# Altium schematic sheet [13]-FPGA_Bank_6_Interface.SchDoc
size A3
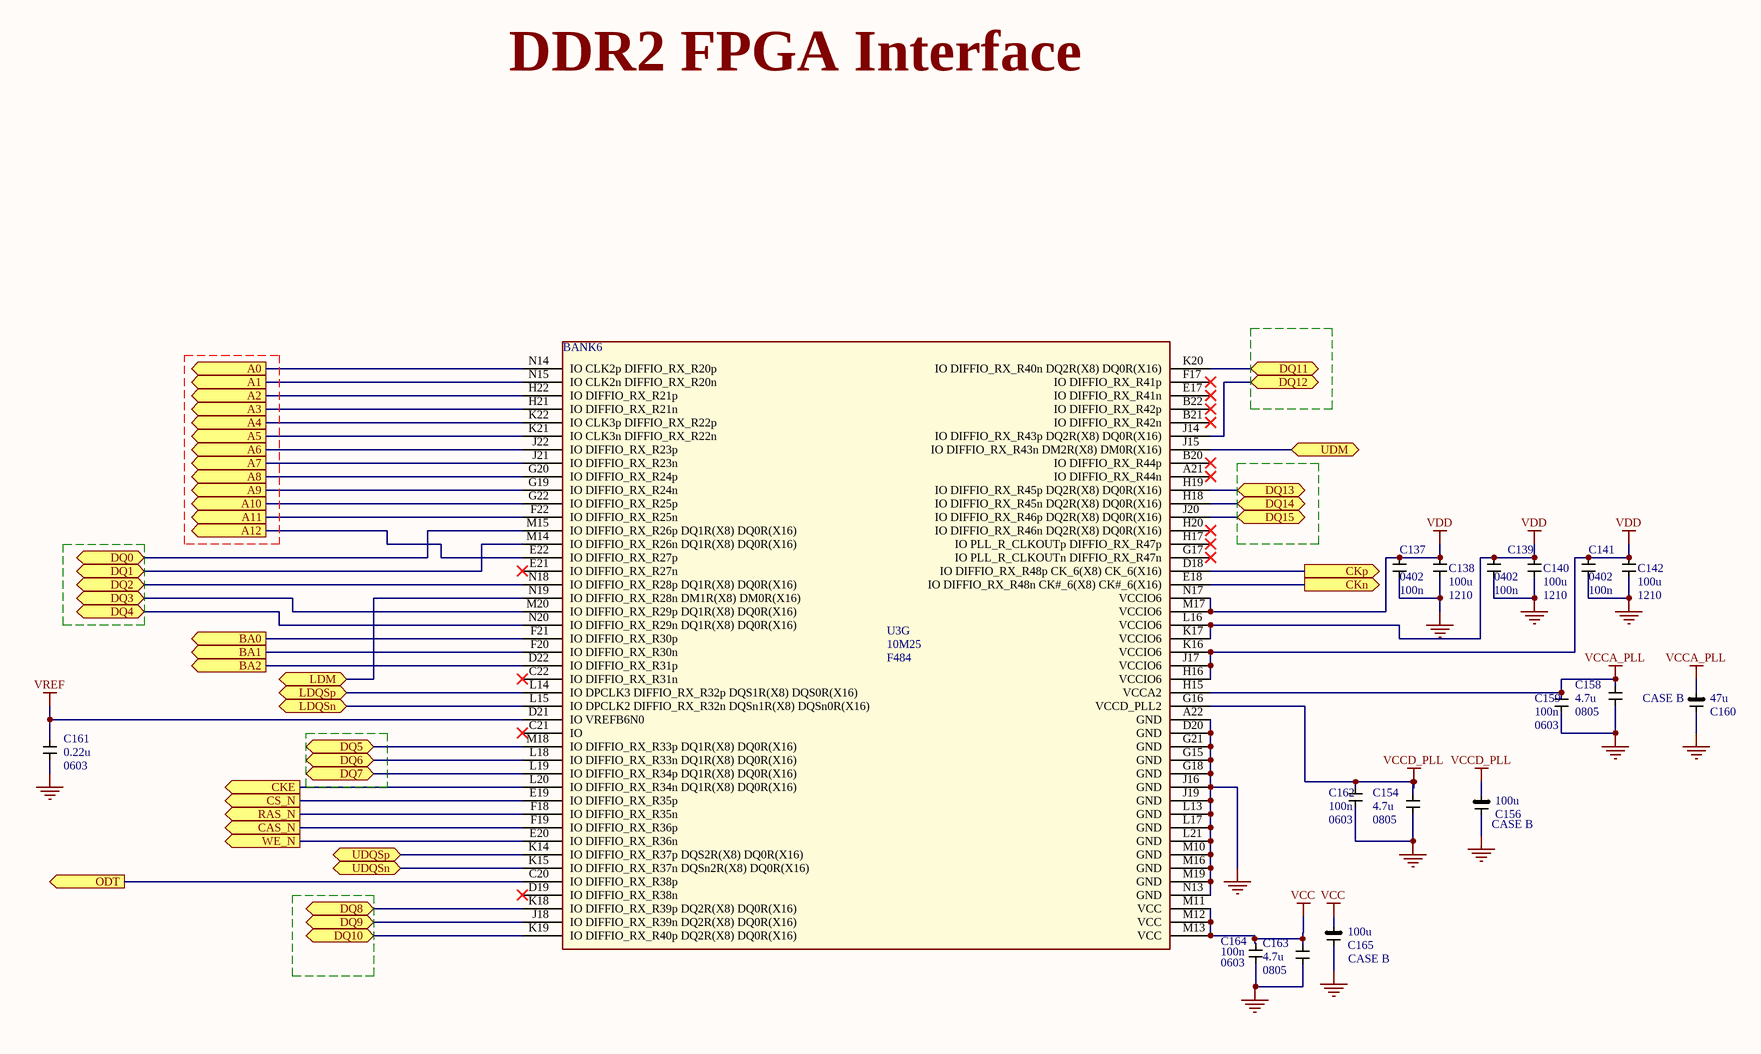
[diagram p0: [13]-FPGA_Bank_6_Interface.SchDoc]

## Parts
C137  100n
C138  100u  PCB package type: 1210  [CAPC3225X28N]
C139  100n
C140  100u  PCB package type: 1210  [CAPC3225X28N]
C141  100n
C142  100u  PCB package type: 1210  [CAPC3225X28N]
C154  4.7u  PCB footprint: 0805
C156  100u  CASE: CASE B  [CAPC3529X21N]
C158  4.7u  PCB footprint: 0805
C159  100n  PCB Layer:: 0603  [*0603]
C160  47u  CASE: CASE B  [CAPC3529X21N]
C161  0.22u  PCB Layer:: 0603  [*0603]
C162  100n  PCB Layer:: 0603  [*0603]
C163  4.7u  PCB footprint: 0805
C164  100n  PCB Layer:: 0603  [*0603]
C165  100u  CASE: CASE B  [CAPC3529X21N]
U3  10M25  Package Type: F484  [*BGA484C100P22X22_2300X2300X200N]  (part G of 9)

## Ports
A0 (out), A1 (out), A2 (out), A3 (out), A4 (out), A5 (out), A6 (out), A7 (out), A8 (out), A9 (out), A10 (out), A11 (out), A12 (out), BA0 (out), BA1 (out), BA2 (out), CAS_N (out), CKE (out), CKn (out), CKp (out), CS_N (out), DQ0, DQ1, DQ2, DQ3, DQ4, DQ5, DQ6, DQ7, DQ8, DQ9, DQ10, DQ11, DQ12, DQ13, DQ14, DQ15, LDM (bidir), LDQSn (bidir), LDQSp (bidir), ODT (out), RAS_N (out), UDM, UDQSn (bidir), UDQSp (bidir), WE_N (out)

## Nets
GND: C137.1 C138.1 C139.1 C140.1 C141.1 C142.1 C154.1 C156.2 C158.1 C159.1 C160.2 C161.1 C162.1 C163.1 C164.1 C165.2 U3.A22(GND) U3.D20(GND) U3.G15(GND) U3.G18(GND) U3.G21(GND) U3.J16(GND) U3.J19(GND) U3.L13(GND) U3.L17(GND) U3.L21(GND) U3.M10(GND) U3.M16(GND) U3.M19(GND) U3.N13(GND)
VCC: C163.2 C164.2 C165.1 U3.M11(VCC) U3.M12(VCC) U3.M13(VCC)
VCCA_PLL: C158.2 C159.2 C160.1 U3.H15(VCCA2)
VCCD_PLL: C154.2 C156.1 C162.2 U3.G16(VCCD_PLL2)
VDD: C137.2 C138.2 C139.2 C140.2 C141.2 C142.2 U3.H16(VCCIO6) U3.J17(VCCIO6) U3.K16(VCCIO6) U3.K17(VCCIO6) U3.L16(VCCIO6) U3.M17(VCCIO6) U3.N17(VCCIO6)
VREF: C161.2 U3.D21(IO_VREFB6N0)
A0: U3.N14(IO_CLK2p_DIFFIO_RX_R20p) ; port A0
A1: U3.N15(IO_CLK2n_DIFFIO_RX_R20n) ; port A1
A2: U3.H22(IO_DIFFIO_RX_R21p) ; port A2
A3: U3.H21(IO_DIFFIO_RX_R21n) ; port A3
A4: U3.K22(IO_CLK3p_DIFFIO_RX_R22p) ; port A4
A5: U3.K21(IO_CLK3n_DIFFIO_RX_R22n) ; port A5
A6: U3.J22(IO_DIFFIO_RX_R23p) ; port A6
A7: U3.J21(IO_DIFFIO_RX_R23n) ; port A7
A8: U3.G20(IO_DIFFIO_RX_R24p) ; port A8
A9: U3.G19(IO_DIFFIO_RX_R24n) ; port A9
A10: U3.G22(IO_DIFFIO_RX_R25p) ; port A10
A11: U3.F22(IO_DIFFIO_RX_R25n) ; port A11
A12: U3.E22(IO_DIFFIO_RX_R27p) ; port A12
BA0: U3.F21(IO_DIFFIO_RX_R30p) ; port BA0
BA1: U3.F20(IO_DIFFIO_RX_R30n) ; port BA1
BA2: U3.D22(IO_DIFFIO_RX_R31p) ; port BA2
CAS_N: U3.F19(IO_DIFFIO_RX_R36p) ; port CAS_N
CKE: U3.L20(IO_DIFFIO_RX_R34n_DQ1R(X8)_DQ0R(X16)) ; port CKE
CKn: U3.E18(IO_DIFFIO_RX_R48n_CK#_6(X8)_CK#_6(X16)) ; port CKn
CKp: U3.D18(IO_DIFFIO_RX_R48p_CK_6(X8)_CK_6(X16)) ; port CKp
CS_N: U3.E19(IO_DIFFIO_RX_R35p) ; port CS_N
DQ0: U3.M15(IO_DIFFIO_RX_R26p_DQ1R(X8)_DQ0R(X16)) ; port DQ0
DQ1: U3.M14(IO_DIFFIO_RX_R26n_DQ1R(X8)_DQ0R(X16)) ; port DQ1
DQ2: U3.N18(IO_DIFFIO_RX_R28p_DQ1R(X8)_DQ0R(X16)) ; port DQ2
DQ3: U3.M20(IO_DIFFIO_RX_R29p_DQ1R(X8)_DQ0R(X16)) ; port DQ3
DQ4: U3.N20(IO_DIFFIO_RX_R29n_DQ1R(X8)_DQ0R(X16)) ; port DQ4
DQ5: U3.M18(IO_DIFFIO_RX_R33p_DQ1R(X8)_DQ0R(X16)) ; port DQ5
DQ6: U3.L18(IO_DIFFIO_RX_R33n_DQ1R(X8)_DQ0R(X16)) ; port DQ6
DQ7: U3.L19(IO_DIFFIO_RX_R34p_DQ1R(X8)_DQ0R(X16)) ; port DQ7
DQ8: U3.K18(IO_DIFFIO_RX_R39p_DQ2R(X8)_DQ0R(X16)) ; port DQ8
DQ9: U3.J18(IO_DIFFIO_RX_R39n_DQ2R(X8)_DQ0R(X16)) ; port DQ9
DQ10: U3.K19(IO_DIFFIO_RX_R40p_DQ2R(X8)_DQ0R(X16)) ; port DQ10
DQ11: U3.K20(IO_DIFFIO_RX_R40n_DQ2R(X8)_DQ0R(X16)) ; port DQ11
DQ12: U3.J14(IO_DIFFIO_RX_R43p_DQ2R(X8)_DQ0R(X16)) ; port DQ12
DQ13: U3.H19(IO_DIFFIO_RX_R45p_DQ2R(X8)_DQ0R(X16)) ; port DQ13
DQ14: U3.H18(IO_DIFFIO_RX_R45n_DQ2R(X8)_DQ0R(X16)) ; port DQ14
DQ15: U3.J20(IO_DIFFIO_RX_R46p_DQ2R(X8)_DQ0R(X16)) ; port DQ15
LDM: U3.N19(IO_DIFFIO_RX_R28n_DM1R(X8)_DM0R(X16)) ; port LDM
LDQSn: U3.L15(IO_DPCLK2_DIFFIO_RX_R32n_DQSn1R(X8)_DQSn0R(X16)) ; port LDQSn
LDQSp: U3.L14(IO_DPCLK3_DIFFIO_RX_R32p_DQS1R(X8)_DQS0R(X16)) ; port LDQSp
ODT: U3.C20(IO_DIFFIO_RX_R38p) ; port ODT
RAS_N: U3.F18(IO_DIFFIO_RX_R35n) ; port RAS_N
UDM: U3.J15(IO_DIFFIO_RX_R43n_DM2R(X8)_DM0R(X16)) ; port UDM
UDQSn: U3.K15(IO_DIFFIO_RX_R37n_DQSn2R(X8)_DQ0R(X16)) ; port UDQSn
UDQSp: U3.K14(IO_DIFFIO_RX_R37p_DQS2R(X8)_DQ0R(X16)) ; port UDQSp
WE_N: U3.E20(IO_DIFFIO_RX_R36n) ; port WE_N

Not connected (* = marked no-connect by the designer): U3 A21(IO_DIFFIO_RX_R44n)* B20(IO_DIFFIO_RX_R44p)* B21(IO_DIFFIO_RX_R42n)* B22(IO_DIFFIO_RX_R42p)* C21(IO)* C22(IO_DIFFIO_RX_R31n)* D19(IO_DIFFIO_RX_R38n)* E17(IO_DIFFIO_RX_R41n)* E21(IO_DIFFIO_RX_R27n)* F17(IO_DIFFIO_RX_R41p)* G17(IO_PLL_R_CLKOUTn_DIFFIO_RX_R47n)* H17(IO_PLL_R_CLKOUTp_DIFFIO_RX_R47p)* H20(IO_DIFFIO_RX_R46n_DQ2R(X8)_DQ0R(X16))*

## Notes on the sheet
- DDR2 FPGA Interface
- (in symbol Component_1) 0402
- (in symbol Component_1, part G) BANK6

## Library data of the parts
C137-C142 C154 C156 C158-C165 = Component_1
  C137 C139 C141: Buying URL: https://uk.farnell.com/avx/04023c104kat2a/cap-0-1-f-25v-10-x7r-0402/dp/1867948?st=100n
  C154 C158 C163: Buying URL:: NEED TO BE ADDED
  C156 C160 C165: Buying URL:: https://uk.farnell.com/avx/tajb107k006tnj/cap-tant-aec-q200-100uf-6-3v-case/dp/2893386?st=100u%20CASE%20B
  C159 C161 C162 C164: Buying URL:: https://uk.farnell.com/avx/0603yc105kat2a/cap-1-f-16v-10-x7r-0603/dp/1658870RL?st=1u%200603
U3 = Component_1: Part no.: 10M25DAF484I7G